# Altium project load-cell.PrjPCB
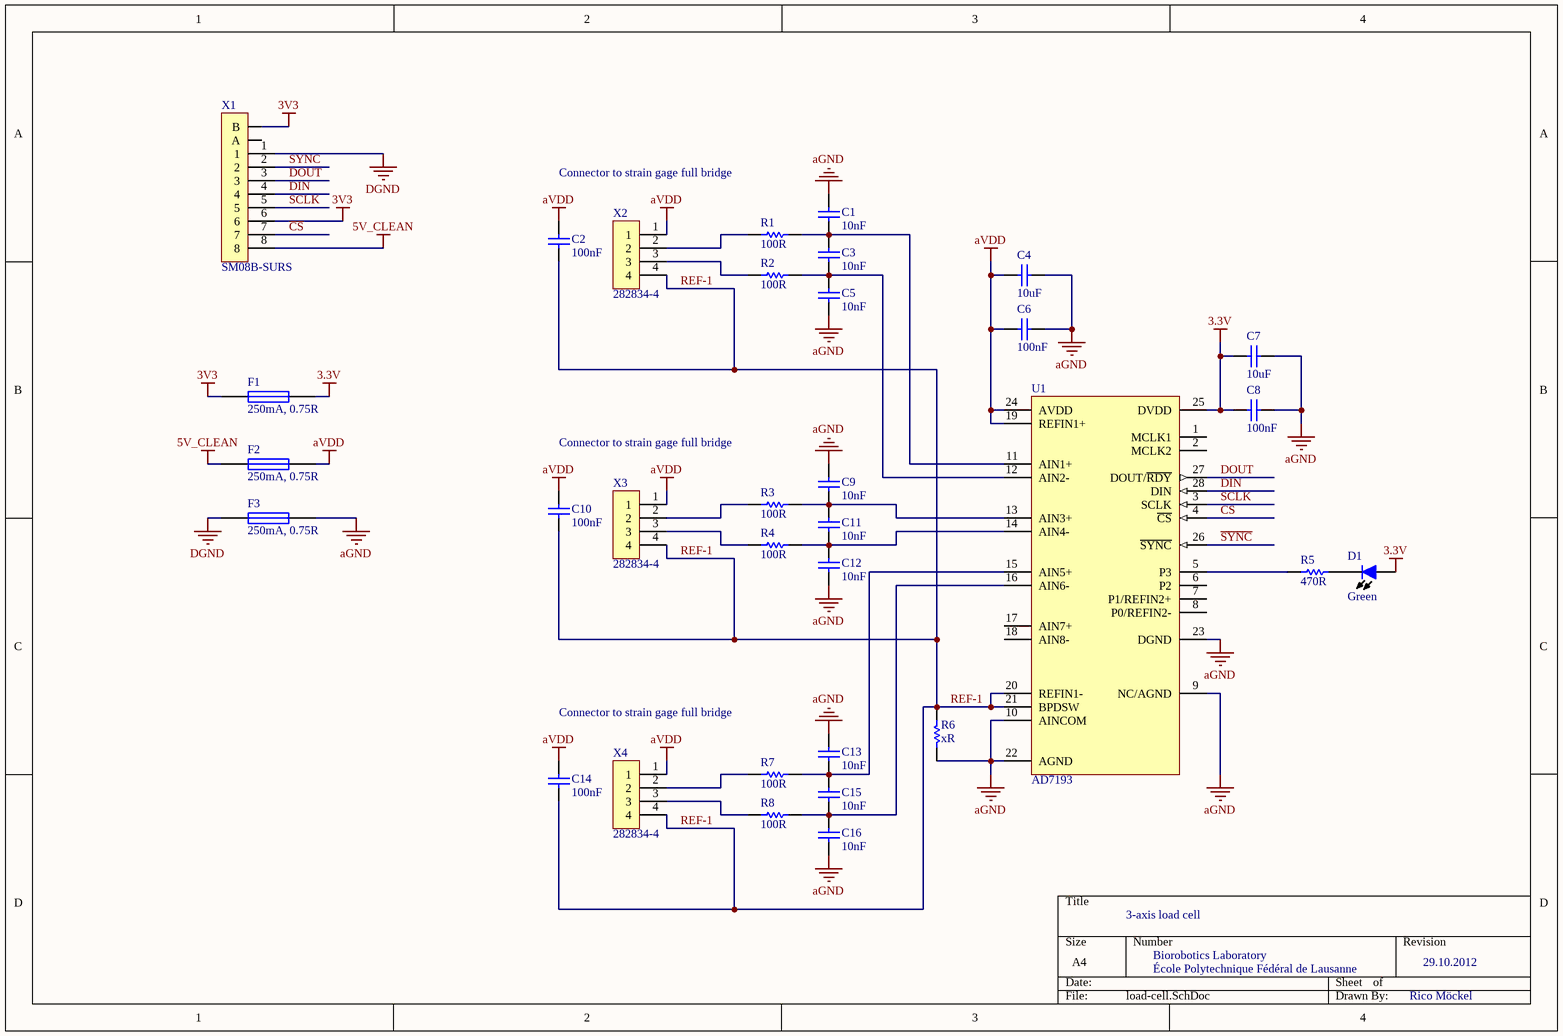
[diagram p0: load-cell.SchDoc]
Title: Load cell
1 sheet, 33 parts. Net scope: global (net labels, ports and power ports of the same name join across sheets).
Board file: load-cell.PcbDoc

## Sheet load-cell.SchDoc: Load cell
size A4

### Parts
C1  10nF  [CAPC1608L]
C2  100nF  [CAPC1608L]
C3  10nF  [CAPC1608L]
C4  10uF  [CAPC1608L]
C5  10nF  [CAPC1608L]
C6  100nF  [CAPC1608L]
C7  10uF  [CAPC1608L]
C8  100nF  [CAPC1608L]
C9  10nF  [CAPC1608L]
C10  100nF  [CAPC1608L]
C11  10nF  [CAPC1608L]
C12  10nF  [CAPC1608L]
C13  10nF  [CAPC1608L]
C14  100nF  [CAPC1608L]
C15  10nF  [CAPC1608L]
C16  10nF  [CAPC1608L]
D1  Color: Green  [RESC1005N]  (hidden comment: LED Green)
F1  250mA, 0.75R  [RESC1608L]
F2  250mA, 0.75R  [RESC1608L]
F3  250mA, 0.75R  [RESC1608L]
R1  100R  [RESC1608L]
R2  100R  [RESC1608L]
R3  100R  [RESC1608L]
R4  100R  [RESC1608L]
R5  470R  [RESC1608L]
R6  xR  [RESC1608L]
R7  100R  [RESC1608L]
R8  100R  [RESC1608L]
U1  AD7193  [TSSOP65-28N-NO_TP]
X1  SM08B-SURS  [SM08B-SURS]
X2  282834-4  [282834-4]
X3  282834-4  [282834-4]
X4  282834-4  [282834-4]

### Nets
3.3V: C7.2 C8.2 D1.1(A) F1.2 U1.25(DVDD)
3V3: F1.1 X1.6 X1.B
5V_CLEAN: F2.1 X1.8
aGND: C1.1 C4.1 C5.2 C6.1 C7.1 C8.1 C9.1 C12.2 C13.1 C16.2 F3.2 R6.2 U1.9(NC/AGND) U1.10(AINCOM) U1.22(AGND) U1.23(DGND)
aVDD: C2.2 C4.2 C6.2 C10.2 C14.2 F2.2 U1.19(REFIN1+) U1.24(AVDD) X2.1 X3.1 X4.1
DGND: F3.1 X1.1
~{CS}: U1.4(~{CS}) X1.7
DIN: U1.28(DIN) X1.4
DOUT: U1.27(DOUT/~{RDY}) X1.3
REF-1: C2.1 C10.1 C14.1 R6.1 U1.20(REFIN1-) U1.21(BPDSW) X2.4 X3.4 X4.4
~{SYNC}: U1.26(~{SYNC}) X1.2
SCLK: U1.3(SCLK) X1.5
NetC1_2: C1.2 C3.1 R1.2 U1.11(AIN1+)
NetC3_2: C3.2 C5.1 R2.2 U1.12(AIN2-)
NetC9_2: C9.2 C11.1 R3.2 U1.13(AIN3+)
NetC11_2: C11.2 C12.1 R4.2 U1.14(AIN4-)
NetC13_2: C13.2 C15.1 R7.2 U1.15(AIN5+)
NetC15_2: C15.2 C16.1 R8.2 U1.16(AIN6-)
NetD1_2: D1.2(C) R5.2
NetR1_1: R1.1 X2.2
NetR2_1: R2.1 X2.3
NetR3_1: R3.1 X3.2
NetR4_1: R4.1 X3.3
NetR5_1: R5.1 U1.5(P3)
NetR7_1: R7.1 X4.2
NetR8_1: R8.1 X4.3

Not connected (* = marked no-connect by the designer): U1 1(MCLK1) 2(MCLK2) 6(P2) 7(P1/REFIN2+) 8(P0/REFIN2-) 17(AIN7+) 18(AIN8-); X1 A

### Notes on the sheet
- Connector to strain gage full bridge
- 3-axis load cell
- École Polytechnique Fédéral de Lausanne
- Biorobotics Laboratory
- 29.10.2012
- Rico Möckel

### Library data of the parts
C1-C16 = Cap: Capacitor; Published: 8-Jun-2000; LatestRevisionDate: 17-Jul-2002; LatestRevisionNote: Re-released for DXP Platform.; PackageReference: RAD-0.3; Publisher: Altium Limited
  C1: Farnell: 1907314
  C7: Farnell: 1962113
D1 = LED
F1-F3 = Fuse 1: Ferrit Bead; Published: 8-Jun-2000; LatestRevisionDate: 17-Jul-2002; LatestRevisionNote: Re-released for DXP Platform.; PackageReference: PIN-W2/E2.8; Publisher: Altium Limited
R1-R8 = Res1: Resistor; Published: 8-Jun-2000; LatestRevisionDate: 17-Jul-2002; LatestRevisionNote: Re-released for DXP Platform.; PackageReference: AXIAL-0.3; Publisher: Altium Limited
  R1: Farnell: 1653251
  R5: Farnell: 1738900
U1 = AD7193_TSSOP: 4-channel 24-bit ADC with PGA
X1 = SM08B-SURS: wire-to-board connector
X2-X4 = 4x1 282834-4: 4-pin connector with screw contacts; Manufacturer: TE CONNECTIVITY / BUCHANAN; Details: 4-pin connector with screw contacts, 2.54mm pitch; Name: 282834-4; Farnell: 1767502; Digikey: A98335-ND